# Altium project Brautomation_V2.PrjPcb (part 2 of 2)

## Sheet BrauV2_Power.SchDoc
size 420 x 297 mm; PageSetup: Record=PageOptions|CenterHorizontal=True|CenterVertical=True|PrintScale=1.01|XCorrection=1.00|YCorrection=1.00|PrintKind=1|BorderSize=5000000|LeftOffset=0|BottomOffset=0|Orientation=2|PaperLength=1000|PaperWidth=1000|Scale=100|PaperSource=7|PrintQuality=-4|MediaType=1|DitherType=10|PaperKind=A3|PrintScaleMode=1; DocumentNumber: 3; SheetNumber: 3; SheetTotal: 22
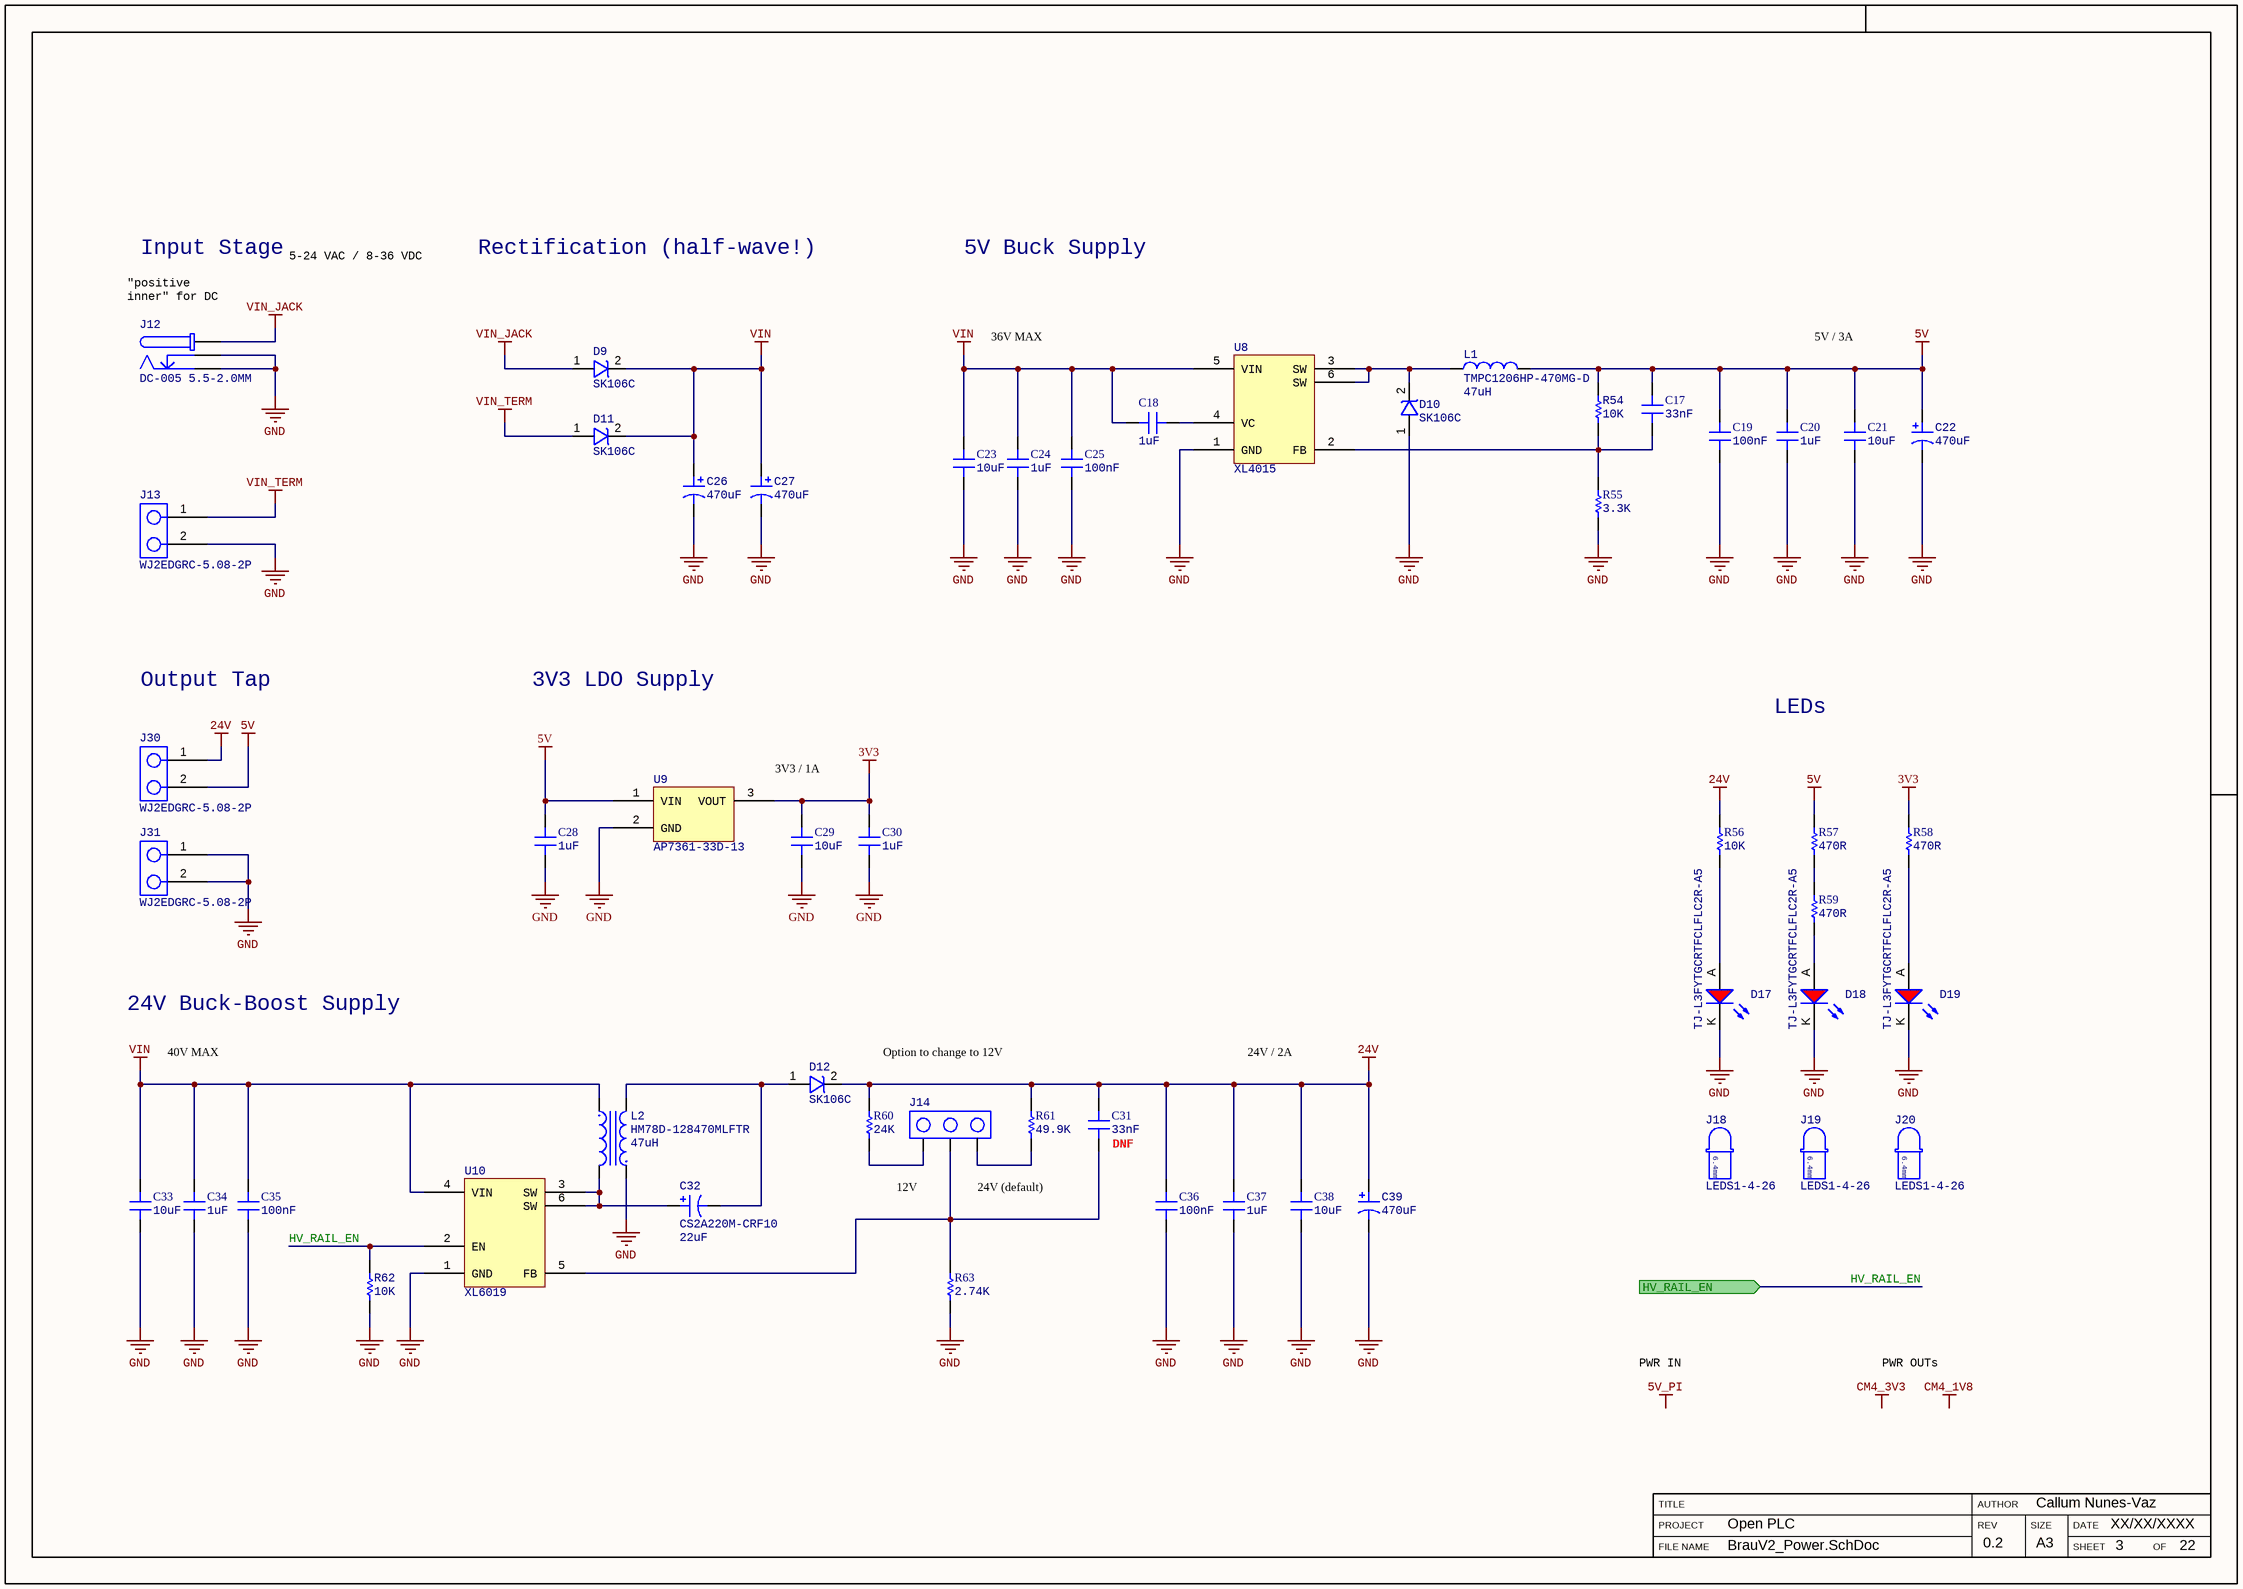
[diagram p9: BrauV2_Power.SchDoc]

### Parts
C17  Capacitance: 33nF  [SMD_CAP_0402(1005)_N]  (hidden comment: CC0402KRX7R9BB333)
C18  Capacitance: 1uF  [SMD_CAP_0603(0201)_N]  (hidden comment: CC0603KRX5R9BB105)
C19  Capacitance: 100nF  [SMD_CAP_0402(1005)_N]  (hidden comment: CC0402KRX5R9BB104)
C20  Capacitance: 1uF  [SMD_CAP_0603(0201)_N]  (hidden comment: CC0603KRX5R9BB105)
C21  Capacitance: 10uF  [SMD_CAP_1206(3216)_N]  (hidden comment: CC1206KKX5R9BB106)
C22  Capacitance: 470uF  [CAP_SMD_10x10.5mm]  (hidden comment: CK1V471MCRG10)
C23  Capacitance: 10uF  [SMD_CAP_1206(3216)_N]  (hidden comment: CC1206KKX5R9BB106)
C24  Capacitance: 1uF  [SMD_CAP_0603(0201)_N]  (hidden comment: CC0603KRX5R9BB105)
C25  Capacitance: 100nF  [SMD_CAP_0402(1005)_N]  (hidden comment: CC0402KRX5R9BB104)
C26  Capacitance: 470uF  [CAP_SMD_10x10.5mm]  (hidden comment: CK1V471MCRG10)
C27  Capacitance: 470uF  [CAP_SMD_10x10.5mm]  (hidden comment: CK1V471MCRG10)
C28  Capacitance: 1uF  [SMD_CAP_0603(0201)_N]  (hidden comment: CC0603KRX5R9BB105)
C29  Capacitance: 10uF  [SMD_CAP_1206(3216)_N]  (hidden comment: CC1206KKX5R9BB106)
C30  Capacitance: 1uF  [SMD_CAP_0603(0201)_N]  (hidden comment: CC0603KRX5R9BB105)
C31  Capacitance: 33nF  [SMD_CAP_0402(1005)_N]  (hidden comment: CC0402KRX7R9BB333)
C32  CS2A220M-CRF10  Capacitance: 22uF  [CAP_SMD_8x10.5mm]
C33  Capacitance: 10uF  [SMD_CAP_1206(3216)_N]  (hidden comment: CC1206KKX5R9BB106)
C34  Capacitance: 1uF  [SMD_CAP_0603(0201)_N]  (hidden comment: CC0603KRX5R9BB105)
C35  Capacitance: 100nF  [SMD_CAP_0402(1005)_N]  (hidden comment: CC0402KRX5R9BB104)
C36  Capacitance: 100nF  [SMD_CAP_0402(1005)_N]  (hidden comment: CC0402KRX5R9BB104)
C37  Capacitance: 1uF  [SMD_CAP_0603(0201)_N]  (hidden comment: CC0603KRX5R9BB105)
C38  Capacitance: 10uF  [SMD_CAP_1206(3216)_N]  (hidden comment: CC1206KKX5R9BB106)
C39  Capacitance: 470uF  [CAP_SMD_10x10.5mm]  (hidden comment: CK1V471MCRG10)
D9  SK106C  [DO-214AB]
D10  SK106C  [DO-214AB]
D11  SK106C  [DO-214AB]
D12  SK106C  [DO-214AB]
D17  TJ-L3FYTGCRTFCLFLC2R-A5  [LED_3MM_SPACED_6.4MM_RED]
D18  TJ-L3FYTGCRTFCLFLC2R-A5  [LED_3MM_SPACED_6.4MM_RED]
D19  TJ-L3FYTGCRTFCLFLC2R-A5  [LED_3MM_SPACED_6.4MM_RED]
J12  DC-005 5.5-2.0MM  [DC-005 5.5-2.0MM]
J13  WJ2EDGRC-5.08-2P  [796638-2]
J14  12251103CNG0S115001  [Header_3POS]  (value not drawn)
J18  LEDS1-4-26  [3MM_LED_SPACER_6.4MM]
J19  LEDS1-4-26  [3MM_LED_SPACER_6.4MM]
J20  LEDS1-4-26  [3MM_LED_SPACER_6.4MM]
J30  WJ2EDGRC-5.08-2P  [796638-2]
J31  WJ2EDGRC-5.08-2P  [796638-2]
L1  TMPC1206HP-470MG-D  Inductance: 47uH  [TMPC1206HP-470MG-D]
L2  HM78D-128470MLFTR  Parallel Inductance: 47uH  [HM78D-128470MLFTR]
R54  Resistance: 10K  [SMD_RES_0402(1005)_N]  (hidden comment: RC0402FR-0710KL)
R55  Resistance: 3.3K  [SMD_RES_0402(1005)_N]  (hidden comment: RC0402FR-073K3L)
R56  Resistance: 10K  [SMD_RES_0402(1005)_N]  (hidden comment: RC0402FR-0710KL)
R57  Resistance: 470R  [SMD_RES_0402(1005)_N]  (hidden comment: RC0402FR-07470RL)
R58  Resistance: 470R  [SMD_RES_0402(1005)_N]  (hidden comment: RC0402FR-07470RL)
R59  Resistance: 470R  [SMD_RES_0402(1005)_N]  (hidden comment: RC0402FR-07470RL)
R60  Resistance: 24K  [SMD_RES_0402(1005)_N]  (hidden comment: RC0402FR-0724KL)
R61  Resistance: 49.9K  [SMD_RES_0402(1005)_N]  (hidden comment: RC0402FR-0749K9L)
R62  Resistance: 10K  [SMD_RES_0402(1005)_N]  (hidden comment: RC0402FR-0710KL)
R63  Resistance: 2.74K  [SMD_RES_0402(1005)_N]  (hidden comment: RC0402FR-072K74L)
U8  XL4015  [TO-263-5]
U9  AP7361-33D-13  [TO-252]
U10  XL6019  [TO-263-5]

### Ports
HV_RAIL_EN (in)

### Nets
3V3: C29.2 C30.2 R58.2 U9.3(VOUT)
5V: C17.2 C19.2 C20.2 C21.2 C22.1 C28.2 J30.2 L1.2 R54.2 R57.2 U9.1(VIN)
24V: C31.2 C36.2 C37.2 C38.2 C39.1 D12.2(CATHODE) J30.1 R56.2 R60.2 R61.2
GND: C19.1 C20.1 C21.1 C22.2 C23.1 C24.1 C25.1 C26.2 C27.2 C28.1 C29.1 C30.1 C33.1 C34.1 C35.1 C36.1 C37.1 C38.1 C39.2 D10.1(ANODE) D17.K D18.K D19.K J12.2 J12.3 J13.2 J31.1 J31.2 L2.1 R55.1 R62.1 R63.1 U8.1(GND) U9.2(GND) U10.1(GND)
VIN: C18.2 C23.2 C24.2 C25.2 C26.1 C27.1 C33.2 C34.2 C35.2 D9.2(CATHODE) D11.2(CATHODE) L2.2 U8.5(VIN) U10.4(VIN)
VIN_JACK: D9.1(ANODE) J12.4
VIN_TERM: D11.1(ANODE) J13.1
HV_RAIL_EN: R62.2 U10.2(EN) ; port HV_RAIL_EN  [project net EXP_GPIO5]
NetC17_1: C17.1 R54.1 R55.2 U8.2(FB)
NetC18_1: C18.1 U8.4(VC)
NetC31_1: C31.1 J14.2 R63.2 U10.5(FB)
NetC32_1: C32.1 L2.4 U10.3(SW) U10.6(SW)
NetC32_2: C32.2 D12.1(ANODE) L2.3
NetD10_2: D10.2(CATHODE) L1.1 U8.3(SW) U8.6(SW)
NetD17_A: D17.A R56.1
NetD18_A: D18.A R59.1
NetD19_A: D19.A R58.1
NetJ14_1: J14.1 R60.1
NetJ14_3: J14.3 R61.1
NetR57_1: R57.1 R59.2

### Notes on the sheet
- Input Stage
- 5-24 VAC / 8-36 VDC
- Rectification (half-wave!)
- 5V Buck Supply
- (near J12) "positive inner" for DC Supplies
- 36V MAX
- 5V / 3A
- Output Tap
- 3V3 LDO Supply
- LEDs
- 3V3 / 1A
- 24V Buck-Boost Supply
- 40V MAX
- Option to change to 12V
- 24V / 2A
- 12V
- 24V (default)
- (near C31) DNF
- PWR IN
- PWR OUTs
- Labels drawn without touching a wire or pin: 5V_PI, CM4_1V8, CM4_3V3
- FILE NAME
- PROJECT
- TITLE
- REV
- AUTHOR
- SIZE
- SHEET
- DATE
- OF
- A3
- (in symbol LEDS1-4-26) 6.4mm

### Library data of the parts
C17 C31 = 33nF 0402 50V 10%: 33nF ±10% 50V X7R 0402 Multilayer Ceramic Capacitors MLCC - SMD/SMT RoHS; Package: 0402; Tolerance: 10%; Voltage Rating: 50V
C18 C20 C24 C28 C30 C34 C37 = 1uF 0603 50V 10%: 1uF ±10% 50V X5R 0603 Multilayer Ceramic Capacitors MLCC - SMD/SMT RoHS; Package: 0603; Tolerance: 10%; Voltage Rating: 50V
C19 C25 C35 C36 = 100nF 0402 50V 10%: 100nF ±10% 50V X5R 0402 Multilayer Ceramic Capacitors MLCC - SMD/SMT RoHS; Package: 0402; Tolerance: 10%; Voltage Rating: 50V
C21 C23 C29 C33 C38 = 10uF 1206 50V 10%: 10uF ±10% 50V X5R 1206 Multilayer Ceramic Capacitors MLCC - SMD/SMT RoHS; Package: 1206; Tolerance: 10%; Voltage Rating: 50V
C22 C26 C27 C39 = CK1V471MCRG10: 470uF ±20% 35V SMD,10x10.5mm Aluminum Electrolytic Capacitors - SMD RoHS; Voltage Max: 35V; Tolerance: 20%
C32 = CS2A220M-CRF10: 22uF ±20% 100V SMD,8x10.5mm Aluminum Electrolytic Capacitors - SMD RoHS; Voltage Max: 100V; Tolerance: 20%
D9-D12 = SK106C: 60V 10A 850mV @ 10A SMC(DO-214AB) Schottky Barrier Diodes (SBD) RoHS
D17-D19 = TJ-L3FYTGCRTFCLFLC2R-A5: LED 3mm Red 620nm~630nm 1.8V~2.6V Through Hole Light Emitting Diodes (LED) RoHS C331031
J12 = DC-005 5.5-2.0MM: Through Hole AC/DC Power Plugs & Receptacles RoHS
J13 J30 J31 = WJ2EDGRC-5.08-2P: Covered（4Sided） 2 1 0.200"（5.08mm） 2 P=5.08mm Pluggable System Terminal Block RoHS
J14 = 3-way Jumper: Pin Header 3 1 right-angle，180degrees 2.54mm Through Hole,P=2.54mm Pin Header & Female Header RoHS
J18-J20 = LEDS1-4-26: 3mm LED spacer 6.4mm height
L1 = TMPC1206HP-470MG-D: 47uH ±20% 5.5A 80mΩ SMD,13.5x12.5x5.7mm Power Inductors RoHS; Saturation Current: 7A; DC Resistance: 80mR; Current Max: 5.5A; Size: 13.5x12.5x5.7mm
L2 = HM78D-128470MLFTR: Coupled Inductors 47uH 20%; Current Max: 5.2A; DC Resistance: 90mR; Size: 12.5x12.5x8.05mm
R54 R56 R62 = 10K 0402 1% 1/16W: 10kΩ ±1% 1/16W ±100ppm/℃ 0402 Chip Resistor - Surface Mount RoHS; Package: 0402; Tolerance: 1%; Power Rating: 1/16W
R55 = 3K3 0402 1% 1/16W: 3.3kΩ ±1% 1/16W ±100ppm/℃ 0402 Chip Resistor - Surface Mount RoHS; Package: 0402; Tolerance: 1%; Power Rating: 1/16W
R57-R59 = 470R 0402 1% 1W: 470Ω ±1% 1/16W ±100ppm/℃ 0402 Chip Resistor - Surface Mount RoHS; Power Rating: 1W; Package: 0402; Tolerance: 1%
R60 = 24K 0402 1% 1/16W: 24kΩ ±1% 1/16W ±100ppm/℃ 0402 Chip Resistor - Surface Mount RoHS; Package: 0402; Tolerance: 1%; Power Rating: 1/16W
R61 = 49K9 0402 1% 1/16W: 49.9kΩ ±1% 1/16W ±100ppm/℃ 0402 Chip Resistor - Surface Mount RoHS; Package: 0402; Tolerance: 1%; Power Rating: 1/16W
R63 = 2K74 0402 1% 1/16W: 2.74kΩ ±1% 1/16W ±100ppm/℃ 0402 Chip Resistor - Surface Mount RoHS; Package: 0402; Tolerance: 1%; Power Rating: 1/16W
U8 = XL4015: XLSEMI 5A 180KHz 36V Buck DC to DC Converter
U9 = AP7361-33D-13: Fixed 6V 3.3V 700mV @ 1A TO-252 Dropout Regulators(LDO) RoHS
U10 = XL6019: XLSEMI 180KHz 60V 5A Switching Current Boost / Buck-Boost / Inverting DC/DC Converter

## Sheet BrauV2_1Wire.SchDoc
size 420 x 297 mm; PageSetup: Record=PageOptions|CenterHorizontal=True|CenterVertical=True|PrintScale=1.01|XCorrection=1.00|YCorrection=1.00|PrintKind=1|BorderSize=5000000|LeftOffset=0|BottomOffset=0|Orientation=2|PaperLength=1000|PaperWidth=1000|Scale=100|PaperSource=7|PrintQuality=-4|MediaType=1|DitherType=10|PaperKind=A3|PrintScaleMode=1; DocumentNumber: 8; SheetNumber: 8; SheetTotal: 22
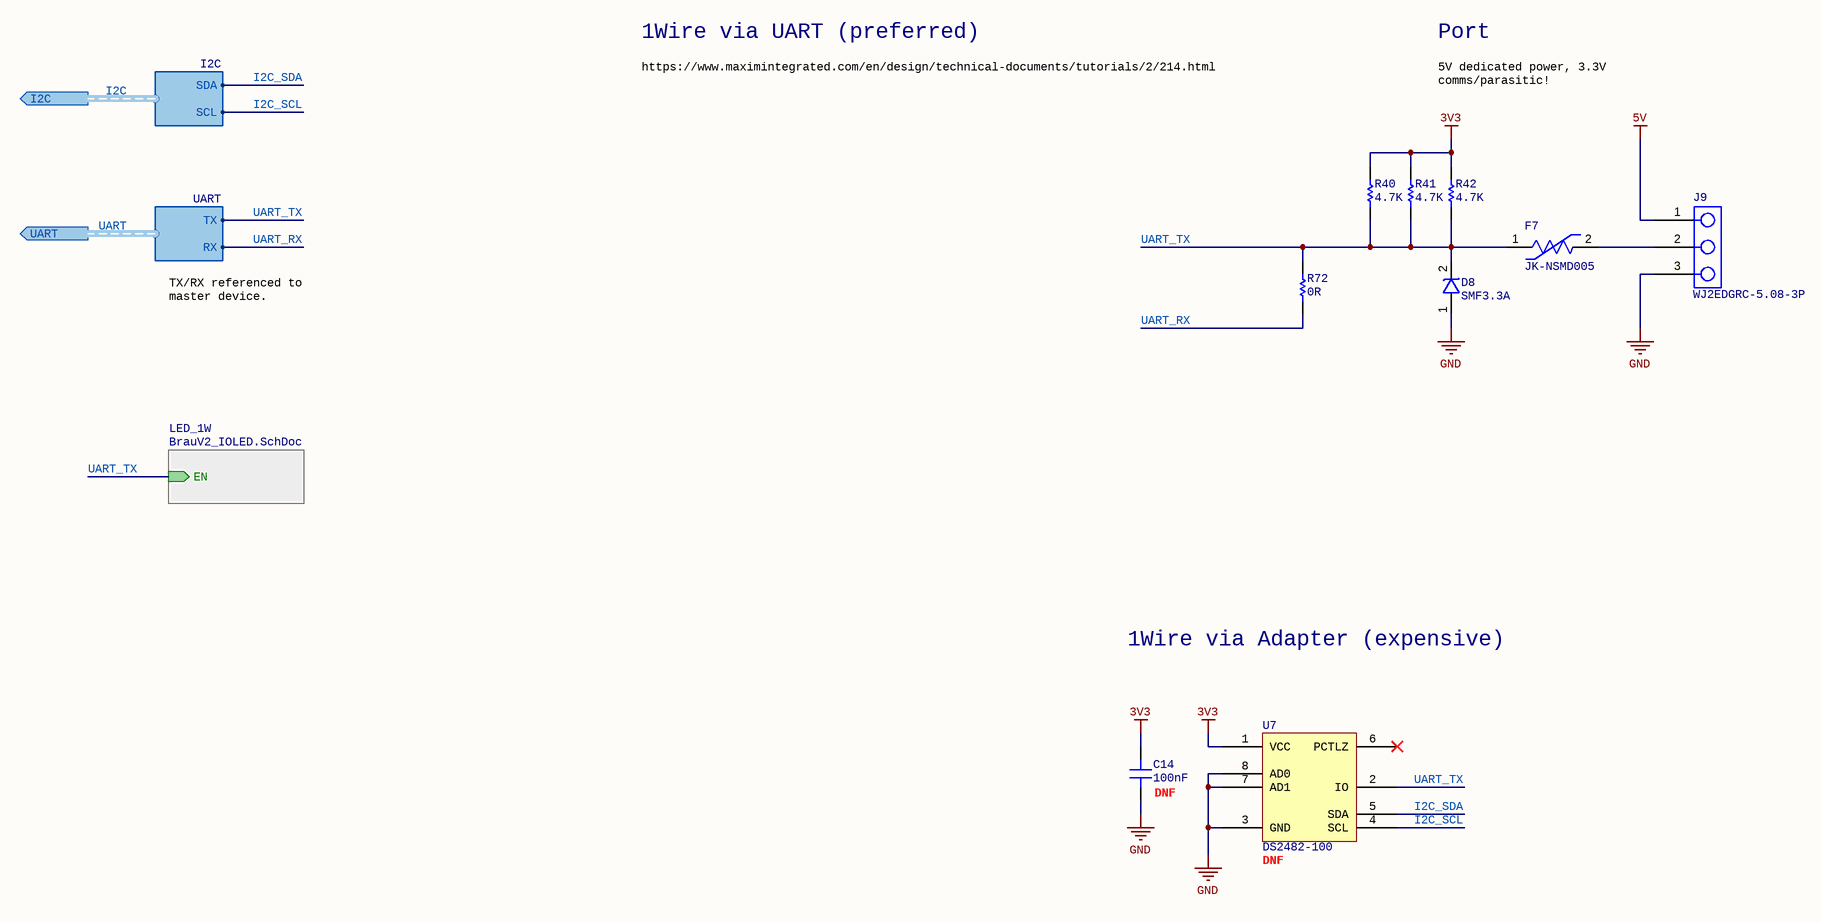
[diagram p10: BrauV2_1Wire.SchDoc]

### Parts
C14  Capacitance: 100nF  [SMD_CAP_0402(1005)_N]  (hidden comment: CC0402KRX5R6BB104)
D8  SMF3.3A  [SOD-123FL]
F7  JK-NSMD005  [SMD_RES_1206(3216)_N]
J9  WJ2EDGRC-5.08-3P  [796638-3]
R40  Resistance: 4.7K  [SMD_RES_0402(1005)_N]  (hidden comment: RC0402FR-074K7L)
R41  Resistance: 4.7K  [SMD_RES_0402(1005)_N]  (hidden comment: RC0402FR-074K7L)
R42  Resistance: 4.7K  [SMD_RES_0402(1005)_N]  (hidden comment: RC0402FR-074K7L)
R72  Resistance: 0R  [SMD_RES_0402(1005)_N]  (hidden comment: RC0402FR-070RL)
U7  DS2482-100  [SOIC-8-3.9mm]

### Sub-sheets
LED_1W = BrauV2_IOLED.SchDoc (file not in this document): EN (in)

### Ports
I2C (out, harness I2C), UART (out, harness UART)

### Harnesses
I2C: SDA, SCL
UART: TX, RX

### Nets
3V3: C14.2 R40.2 R41.2 R42.2 U7.1(VCC)
5V: J9.1
GND: C14.1 D8.1(ANODE) J9.3 U7.3(GND) U7.7(AD1) U7.8(AD0)
I2C_SCL: U7.4(SCL) ; port I2C.SCL  [project net I2C.SCL]
I2C_SDA: U7.5(SDA) ; port I2C.SDA  [project net I2C.SDA]
UART_RX: R72.1 ; port UART.RX  [project net STM_UART3.RX]
UART_TX: D8.2(CATHODE) F7.1 R40.1 R41.1 R42.1 R72.2 U7.2(IO) ; sheet LED_1W/EN, port UART.TX  [project net STM_UART3.TX]
NetF7_2: F7.2 J9.2

Not connected (* = marked no-connect by the designer): U7 6(PCTLZ)*

### Buses and harness runs
harness I2C = port I2C
harness UART = port UART

### Notes on the sheet
- 1Wire via UART (preferred)
- Port
- https://www.maximintegrated.com/en/design/technical-documents/tutorials/2/214.html
- 5V dedicated power, 3.3V comms/parasitic!
- TX/RX referenced to master device.
- 1Wire via Adapter (expensive)
- (near C14) DNF
- (near U7) DNF
- FILE NAME
- PROJECT
- TITLE
- REV
- AUTHOR
- SIZE
- SHEET
- DATE
- OF
- A3

### Library data of the parts
C14 = 100nF 0402 10V 10%: 100nF ±10% 10V X5R 0402 Multilayer Ceramic Capacitors MLCC - SMD/SMT RoHS; Package: 0402; Tolerance: 10%; Voltage Rating: 10V
D8 = SMF3.3A: Unidirectional 3.3V 5.2V 8V 25A SOD-123 TVS RoHS
F7 = JK-NSMD005: 60V 150mA 1.5s 1206 PTC Resettable Fuses RoHS
J9 = WJ2EDGRC-5.08-3P: Covered（4Sided） 3 1 0.200"（5.08mm） 3 P=5.08mm Pluggable System Terminal Block RoHS
R40-R42 = 4K7 0402 1% 1/16W: 4.7kΩ ±1% 1/16W ±100ppm/℃ 0402 Chip Resistor - Surface Mount RoHS; Package: 0402; Tolerance: 1%; Power Rating: 1/16W
R72 = 0R 0402 1% 1/16W: 0Ω ±1% 1/16W 0402 Chip Resistor - Surface Mount RoHS; Package: 0402; Tolerance: 1%; Power Rating: 1/16W
U7 = DS2482-100: Single-Channel 1-Wire Master

## Sheet BrauV2_GPIOExpander.SchDoc
size 420 x 297 mm; PageSetup: Record=PageOptions|CenterHorizontal=True|CenterVertical=True|PrintScale=1.01|XCorrection=1.00|YCorrection=1.00|PrintKind=1|BorderSize=5000000|LeftOffset=0|BottomOffset=0|Orientation=2|PaperLength=1000|PaperWidth=1000|Scale=100|PaperSource=7|PrintQuality=-4|MediaType=1|DitherType=10|PaperKind=A3|PrintScaleMode=1; DocumentNumber: 22; SheetNumber: 22; SheetTotal: 22
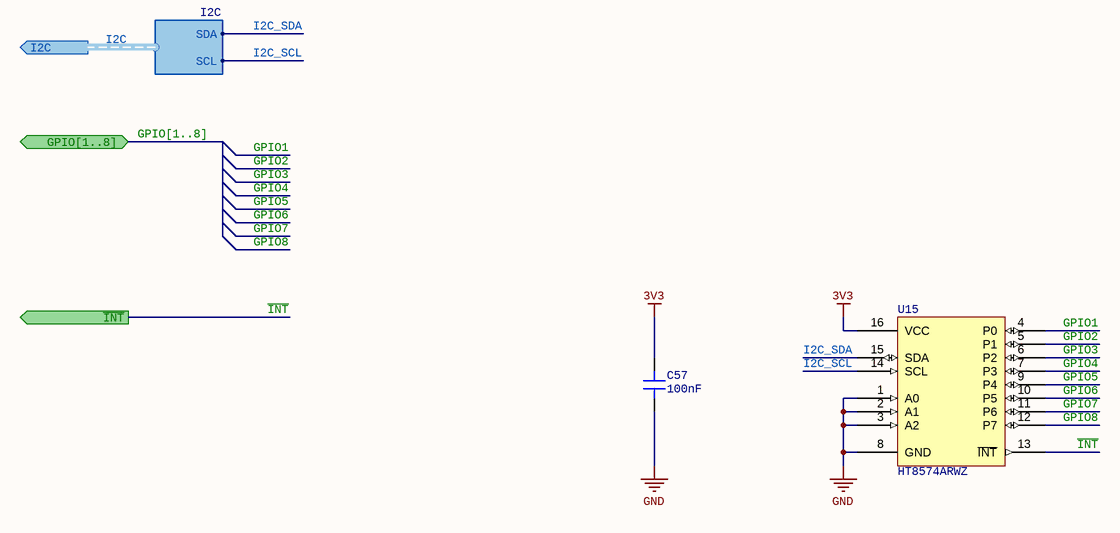
[diagram p11: BrauV2_GPIOExpander.SchDoc]

### Parts
C57  Capacitance: 100nF  [SMD_CAP_0402(1005)_N]  (hidden comment: CC0402KRX5R6BB104)
U15  HT8574ARWZ  [TSSOP-16]

### Ports
GPIO[1..8] (bidir), I2C (out, harness I2C), ~{INT} (out)

### Harnesses
I2C: SDA, SCL

### Nets
3V3: C57.2 U15.16(VCC)
GND: C57.1 U15.1(A0) U15.2(A1) U15.3(A2) U15.8(GND)
GPIO1: U15.4(P0)  [project net CV_CC_MODE_SEL_1]
GPIO2: U15.5(P1)  [project net CV_CC_MODE_SEL_2]
GPIO3: U15.6(P2)  [project net CV_CC_MODE_SEL_1]
GPIO4: U15.7(P3)  [project net CV_CC_MODE_SEL_2]
GPIO5: U15.9(P4)  [project net EXP_GPIO5]
GPIO6: U15.10(P5)  [project net EXP_GPIO6]
GPIO7: U15.11(P6)  [project net EXP_GPIO7]
GPIO8: U15.12(P7)  [project net EXP_GPIO8]
I2C_SCL: U15.14(SCL) ; port I2C.SCL  [project net I2C.SCL]
I2C_SDA: U15.15(SDA) ; port I2C.SDA  [project net I2C.SDA]
~{INT}: U15.13(~{INT}) ; port ~{INT}  [project net GPIO1]

### Buses and harness runs
bus GPIO[1..8] = port GPIO[1..8]
harness I2C = port I2C

### Notes on the sheet
- FILE NAME
- PROJECT
- TITLE
- REV
- AUTHOR
- SIZE
- SHEET
- DATE
- OF
- A3

### Library data of the parts
C57 = 100nF 0402 10V 10%: as C14 on sheet BrauV2_1Wire; Package: 0402; Tolerance: 10%; Voltage Rating: 10V
U15 = HT8574ARWZ: SOP16 Interface - I/O Expanders ROHS (PCF8754 clone)

## Sheet BrauV2_RS485.SchDoc
size 420 x 297 mm; PageSetup: Record=PageOptions|CenterHorizontal=True|CenterVertical=True|PrintScale=1.01|XCorrection=1.00|YCorrection=1.00|PrintKind=1|BorderSize=5000000|LeftOffset=0|BottomOffset=0|Orientation=2|PaperLength=1000|PaperWidth=1000|Scale=100|PaperSource=7|PrintQuality=-4|MediaType=1|DitherType=10|PaperKind=A3|PrintScaleMode=1; DocumentNumber: 21; SheetNumber: 21; SheetTotal: 22
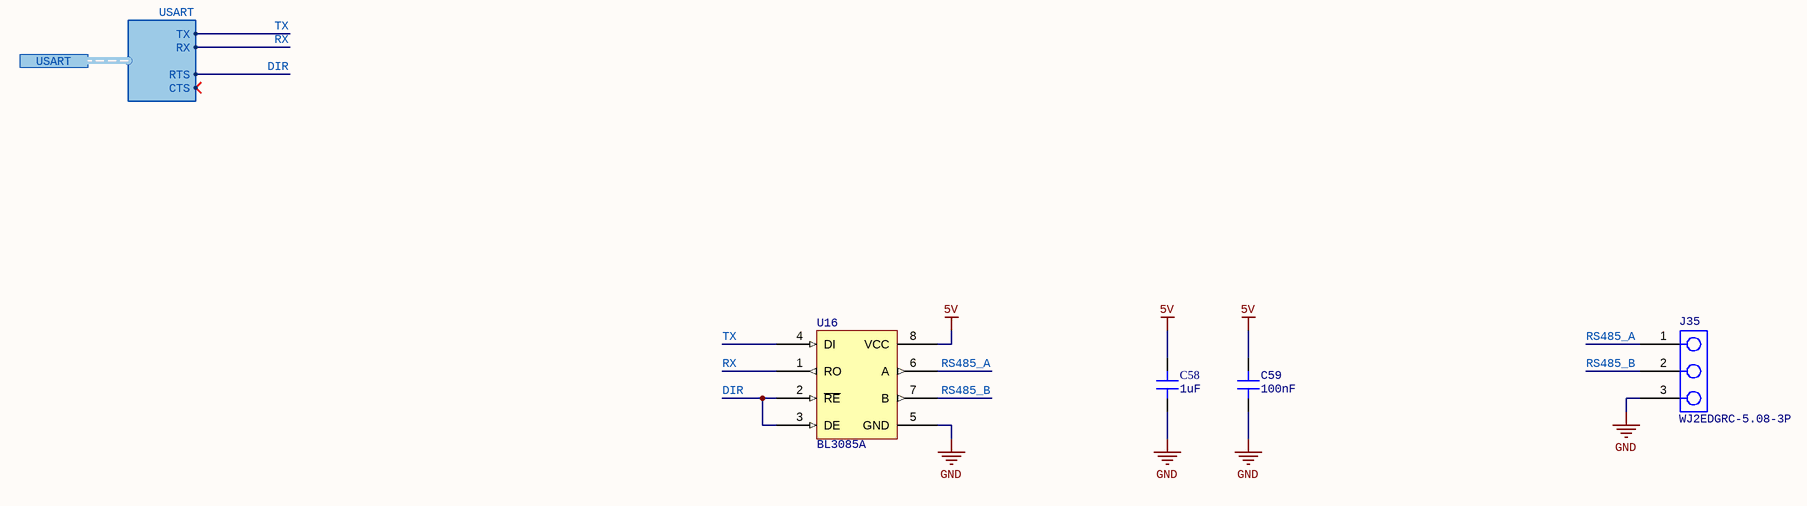
[diagram p12: BrauV2_RS485.SchDoc]

### Parts
C58  Capacitance: 1uF  [SMD_CAP_0603(0201)_N]  (hidden comment: CC0603KRX5R9BB105)
C59  Capacitance: 100nF  [SMD_CAP_0402(1005)_N]  (hidden comment: CC0402KRX5R6BB104)
J35  WJ2EDGRC-5.08-3P  [796638-3]
U16  BL3085A  [SOIC-8-3.9mm]

### Ports
USART (harness USART)

### Harnesses
USART: TX, RX, RTS, CTS

### Nets
5V: C58.2 C59.2 U16.8(VCC)
GND: C58.1 C59.1 J35.3 U16.5(GND)
DIR: U16.2(~{RE}) U16.3(DE) ; port USART.RTS
RS485_A: J35.1 U16.6(A)
RS485_B: J35.2 U16.7(B)
RX: U16.1(RO) ; port USART.RX  [project net GPIO9]
TX: U16.4(DI) ; port USART.TX  [project net GPIO8]

### Notes on the sheet
- FILE NAME
- PROJECT
- TITLE
- REV
- AUTHOR
- SIZE
- SHEET
- DATE
- OF
- A3

### Library data of the parts
C58 = 1uF 0603 50V 10%: as C18 on sheet BrauV2_Power; Package: 0603; Tolerance: 10%; Voltage Rating: 50V
C59 = 100nF 0402 10V 10%: as C14 on sheet BrauV2_1Wire; Package: 0402; Tolerance: 10%; Voltage Rating: 10V
J35 = WJ2EDGRC-5.08-3P: as J9 on sheet BrauV2_1Wire
U16 = BL3085A: SOIC-8_150mil RS-485/RS-422 ICs ROHS (MAX485 clone)

## Nets that join several sheets
3V3: BrauV2_TopLevel (R79.2), BrauV2_ComputeModule (R43.1 R91.1), BrauV2_IOController (17 pins), USBMUX1 (C52_1.2 U13_1.1), USBMUX2 (C52_2.2 U13_2.1), BrauV2_Display (C12.2 J7.14 J7.15), BrauV2_Etherent (10 pins), BrauV2_Power (C29.2 C30.2 R58.2 U9.3), BrauV2_1Wire (5 pins), BrauV2_GPIOExpander (C57.2 U15.16)
5V: AO1 (6 pins), AO2 (6 pins), BrauV2_Buzzer (BZR1.1 R101.2), BrauV2_Display (C13.2 J8.18), BrauV2_Power (11 pins), BrauV2_1Wire (J9.1), BrauV2_RS485 (C58.2 C59.2 U16.8)
24V: AO1 (C2_1.2 U1_1.4), AO2 (C2_2.2 U1_2.4), BrauV2_AnalogueInput (U5.4), BrauV2_Power (10 pins)
GND: BrauV2_TopLevel (R89.1), BrauV2_ComputeModule (54 pins), AO1 (16 pins), AO2 (16 pins), BrauV2_IOController (18 pins), USBMUX1 (C52_1.1 R94_1.1 U13_1.5), USBMUX2 (C52_2.1 R94_2.1 U13_2.5), BrauV2_Buzzer (Q8.2 R103.1), BrauV2_AnalogueInput (17 pins), BrauV2_Display (12 pins), BrauV2_Etherent (C15.1 C16.1 J10.0 J10.8), BrauV2_Power (35 pins), BrauV2_1Wire (6 pins), BrauV2_GPIOExpander (5 pins), BrauV2_RS485 (C58.1 C59.1 J35.3 U16.5)
ADC_IN1: BrauV2_IOController (U11.10), BrauV2_AnalogueInput (R23.1 R26.1)
ADC_IN2: BrauV2_IOController (U11.11), BrauV2_AnalogueInput (R27.1 R30.1)
ADC_IN3: BrauV2_IOController (U11.14), BrauV2_AnalogueInput (R31.1 R34.1)
ADC_IN4: BrauV2_IOController (U11.15), BrauV2_AnalogueInput (R35.1 R38.1)
CV_CC_MODE_SEL_1: AO1 (U2_1.6), BrauV2_GPIOExpander (U15.4)
CV_CC_MODE_SEL_1: AO2 (U2_2.6), BrauV2_GPIOExpander (U15.6)
CV_CC_MODE_SEL_2: AO1 (U3_1.6), BrauV2_GPIOExpander (U15.5)
CV_CC_MODE_SEL_2: AO2 (U3_2.6), BrauV2_GPIOExpander (U15.7)
DIR: BrauV2_ComputeModule (J1.37), BrauV2_RS485 (U16.2 U16.3)
DSI.CLK_N: BrauV2_ComputeModule (J2.31), BrauV2_Display (J7.6)
DSI.CLK_P: BrauV2_ComputeModule (J2.29), BrauV2_Display (J7.5)
DSI.D0_N: BrauV2_ComputeModule (J2.43), BrauV2_Display (J7.8)
DSI.D0_P: BrauV2_ComputeModule (J2.41), BrauV2_Display (J7.9)
DSI.D1_N: BrauV2_ComputeModule (J2.37), BrauV2_Display (J7.2)
DSI.D1_P: BrauV2_ComputeModule (J2.35), BrauV2_Display (J7.3)
~{ETH_LED2}: BrauV2_ComputeModule (J1.18), BrauV2_Etherent (J10.11)
~{ETH_LED3}: BrauV2_ComputeModule (J1.16), BrauV2_Etherent (J10.10)
ETH_GB.D0_N: BrauV2_ComputeModule (J1.9), BrauV2_Etherent (R51.1)
ETH_GB.D0_P: BrauV2_ComputeModule (J1.11), BrauV2_Etherent (R50.1)
ETH_GB.D1_N: BrauV2_ComputeModule (J1.5), BrauV2_Etherent (R53.1)
ETH_GB.D1_P: BrauV2_ComputeModule (J1.3), BrauV2_Etherent (R52.1)
EXP_GPIO5: BrauV2_Power (R62.2 U10.2), BrauV2_GPIOExpander (U15.9)
GPIO1: BrauV2_IOController (U11.16), BrauV2_GPIOExpander (U15.13)
GPIO2: AO1 (U4_1.1), BrauV2_IOController (U11.17)
GPIO3: AO1 (U4_1.2), BrauV2_IOController (U11.29)
GPIO4: BrauV2_ComputeModule (J1.53), BrauV2_IOController (U11.30)
GPIO4: AO1 (U4_1.3), BrauV2_IOController (U11.25)
GPIO5: BrauV2_ComputeModule (J1.33), BrauV2_IOController (U11.31)
GPIO5: AO2 (U4_2.1), BrauV2_IOController (U11.20)
GPIO6: AO2 (U4_2.2), BrauV2_IOController (U11.3)
GPIO7: BrauV2_ComputeModule (J1.38), BrauV2_IOController (U11.37)
GPIO7: AO2 (U4_2.3), BrauV2_IOController (U11.4)
GPIO8: BrauV2_ComputeModule (J1.40), BrauV2_RS485 (U16.4)
GPIO9: BrauV2_ComputeModule (J1.39), BrauV2_RS485 (U16.1)
GPIO10: BrauV2_ComputeModule (J1.43), BrauV2_IOController (U11.34)
HDMI.CEC: BrauV2_ComputeModule (J2.49), BrauV2_Display (J8.13)
HDMI.CLK_N: BrauV2_ComputeModule (J2.12), BrauV2_Display (J8.12)
HDMI.CLK_P: BrauV2_ComputeModule (J2.14), BrauV2_Display (J8.10)
HDMI.D0_N: BrauV2_ComputeModule (J2.18), BrauV2_Display (J8.9)
HDMI.D0_P: BrauV2_ComputeModule (J2.20), BrauV2_Display (J8.7)
HDMI.D1_N: BrauV2_ComputeModule (J2.24), BrauV2_Display (J8.6)
HDMI.D1_P: BrauV2_ComputeModule (J2.26), BrauV2_Display (J8.4)
HDMI.D2_N: BrauV2_ComputeModule (J2.30), BrauV2_Display (J8.3)
HDMI.D2_P: BrauV2_ComputeModule (J2.32), BrauV2_Display (J8.1)
HDMI.HPD: BrauV2_ComputeModule (J2.47), BrauV2_Display (J8.19)
HDMI.SCL: BrauV2_ComputeModule (J2.2), BrauV2_Display (J8.15)
HDMI.SDA: BrauV2_ComputeModule (J2.1), BrauV2_Display (J8.16)
I2C.SCL: BrauV2_IOController (R81.1 U11.45), BrauV2_1Wire (U7.4), BrauV2_GPIOExpander (U15.14)
I2C.SDA: BrauV2_IOController (R82.1 U11.46), BrauV2_1Wire (U7.5), BrauV2_GPIOExpander (U15.15)
I2C_DSI.SCL: BrauV2_ComputeModule (J1.36), BrauV2_Display (J7.11)
I2C_DSI.SDA: BrauV2_ComputeModule (J1.35), BrauV2_Display (J7.12)
MUX_SEL: BrauV2_TopLevel (J11.2), BrauV2_ComputeModule (J1.94), USBMUX1 (U13_1.2), USBMUX2 (U13_2.2)
PWM9: BrauV2_IOController (U11.43), BrauV2_Buzzer (R102.1 R103.2)
~{RESET}: BrauV2_ComputeModule (J1.91), BrauV2_IOController (R80.1 U11.7)
STM_UART3.TX: BrauV2_IOController (U11.21), BrauV2_1Wire (7 pins)
USB_1_D_N: USBMUX1 (U13_1.8), USBMUX2 (U13_2.6)
USB_1_D_P: USBMUX1 (U13_1.9), USBMUX2 (U13_2.7)
USB_COM_D_N: BrauV2_ComputeModule (J2.97), USBMUX1 (U13_1.4)
USB_COM_D_P: BrauV2_ComputeModule (J2.95), USBMUX1 (U13_1.3)

## Assembly variants
Basic: all parts fitted